# Altium schematic sheet ANALOG_PWR.SchDoc
size A4
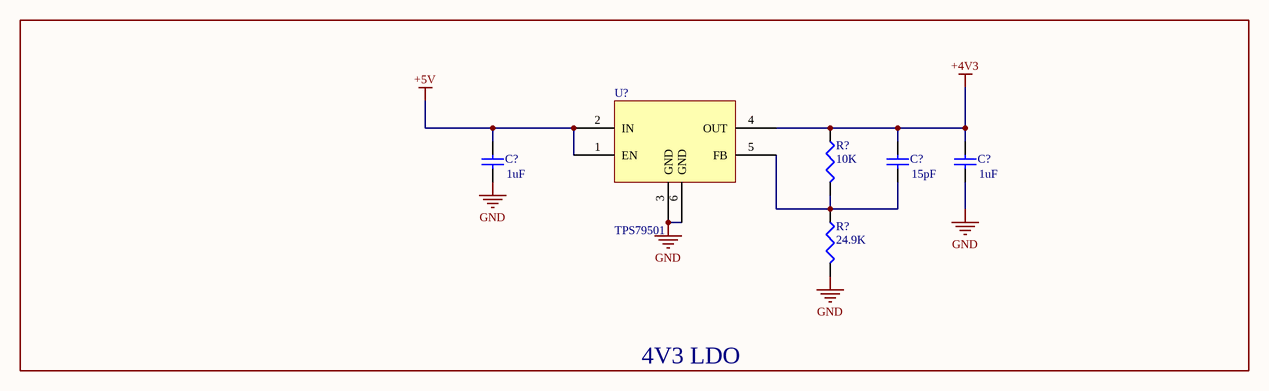
[diagram p0: ANALOG_PWR.SchDoc]

## Parts
(Parts that share a designator on the sheet are numbered #1, #2 ... from top to bottom, then left to right.)
C?#1  value 1uF  [3-0603]
C?#2  value 15pF  [3-0603]
C?#3  value 1uF  [3-0603]
R?#1  value 10K  [3-0603]
R?#2  value 24.9K  [3-0603]
U?  TPS79501  [SOT223-6L]

## Blocks framed on the sheet
4V3 LDO: C?#1-C?#3 R?#1 R?#2 U?

## Nets
+4V3: C?#2.2 C?#3.2 R?#1.1 U?.4(OUT)
+5V: C?#1.2 U?.1(EN) U?.2(IN)
GND: C?#1.1 C?#3.1 R?#2.2 U?.3(GND) U?.6(GND)
NetC?#2_1: C?#2.1 R?#1.2 R?#2.1 U?.5(FB)

## Library data of the parts
C?#1 C?#3 = Cap: MLCC 1uF 0603 X5R 10V; Manufacturer: Murata; Part Number: GRM188R61A105KA61; Cost: 0,005
C?#2 = Cap: MLCC 15pF 0603 C0G 50V; Manufacturer: Murata; Part Number: GRM1885C1H150JA01D; Cost: 0,005
R?#1 = Res3: RES 10k 0603 1%; Manufacturer: ROHM; Part Number: MCR03EZPFX1002; Cost: *
R?#2 = Res3: RES 24.9k 0603 1%; Manufacturer: ROHM; Part Number: MCR03EZPFX2493; Cost: *
U? = TPS79501: Manufacturer: Texas instruments; Part Number: TPS79501DCQ